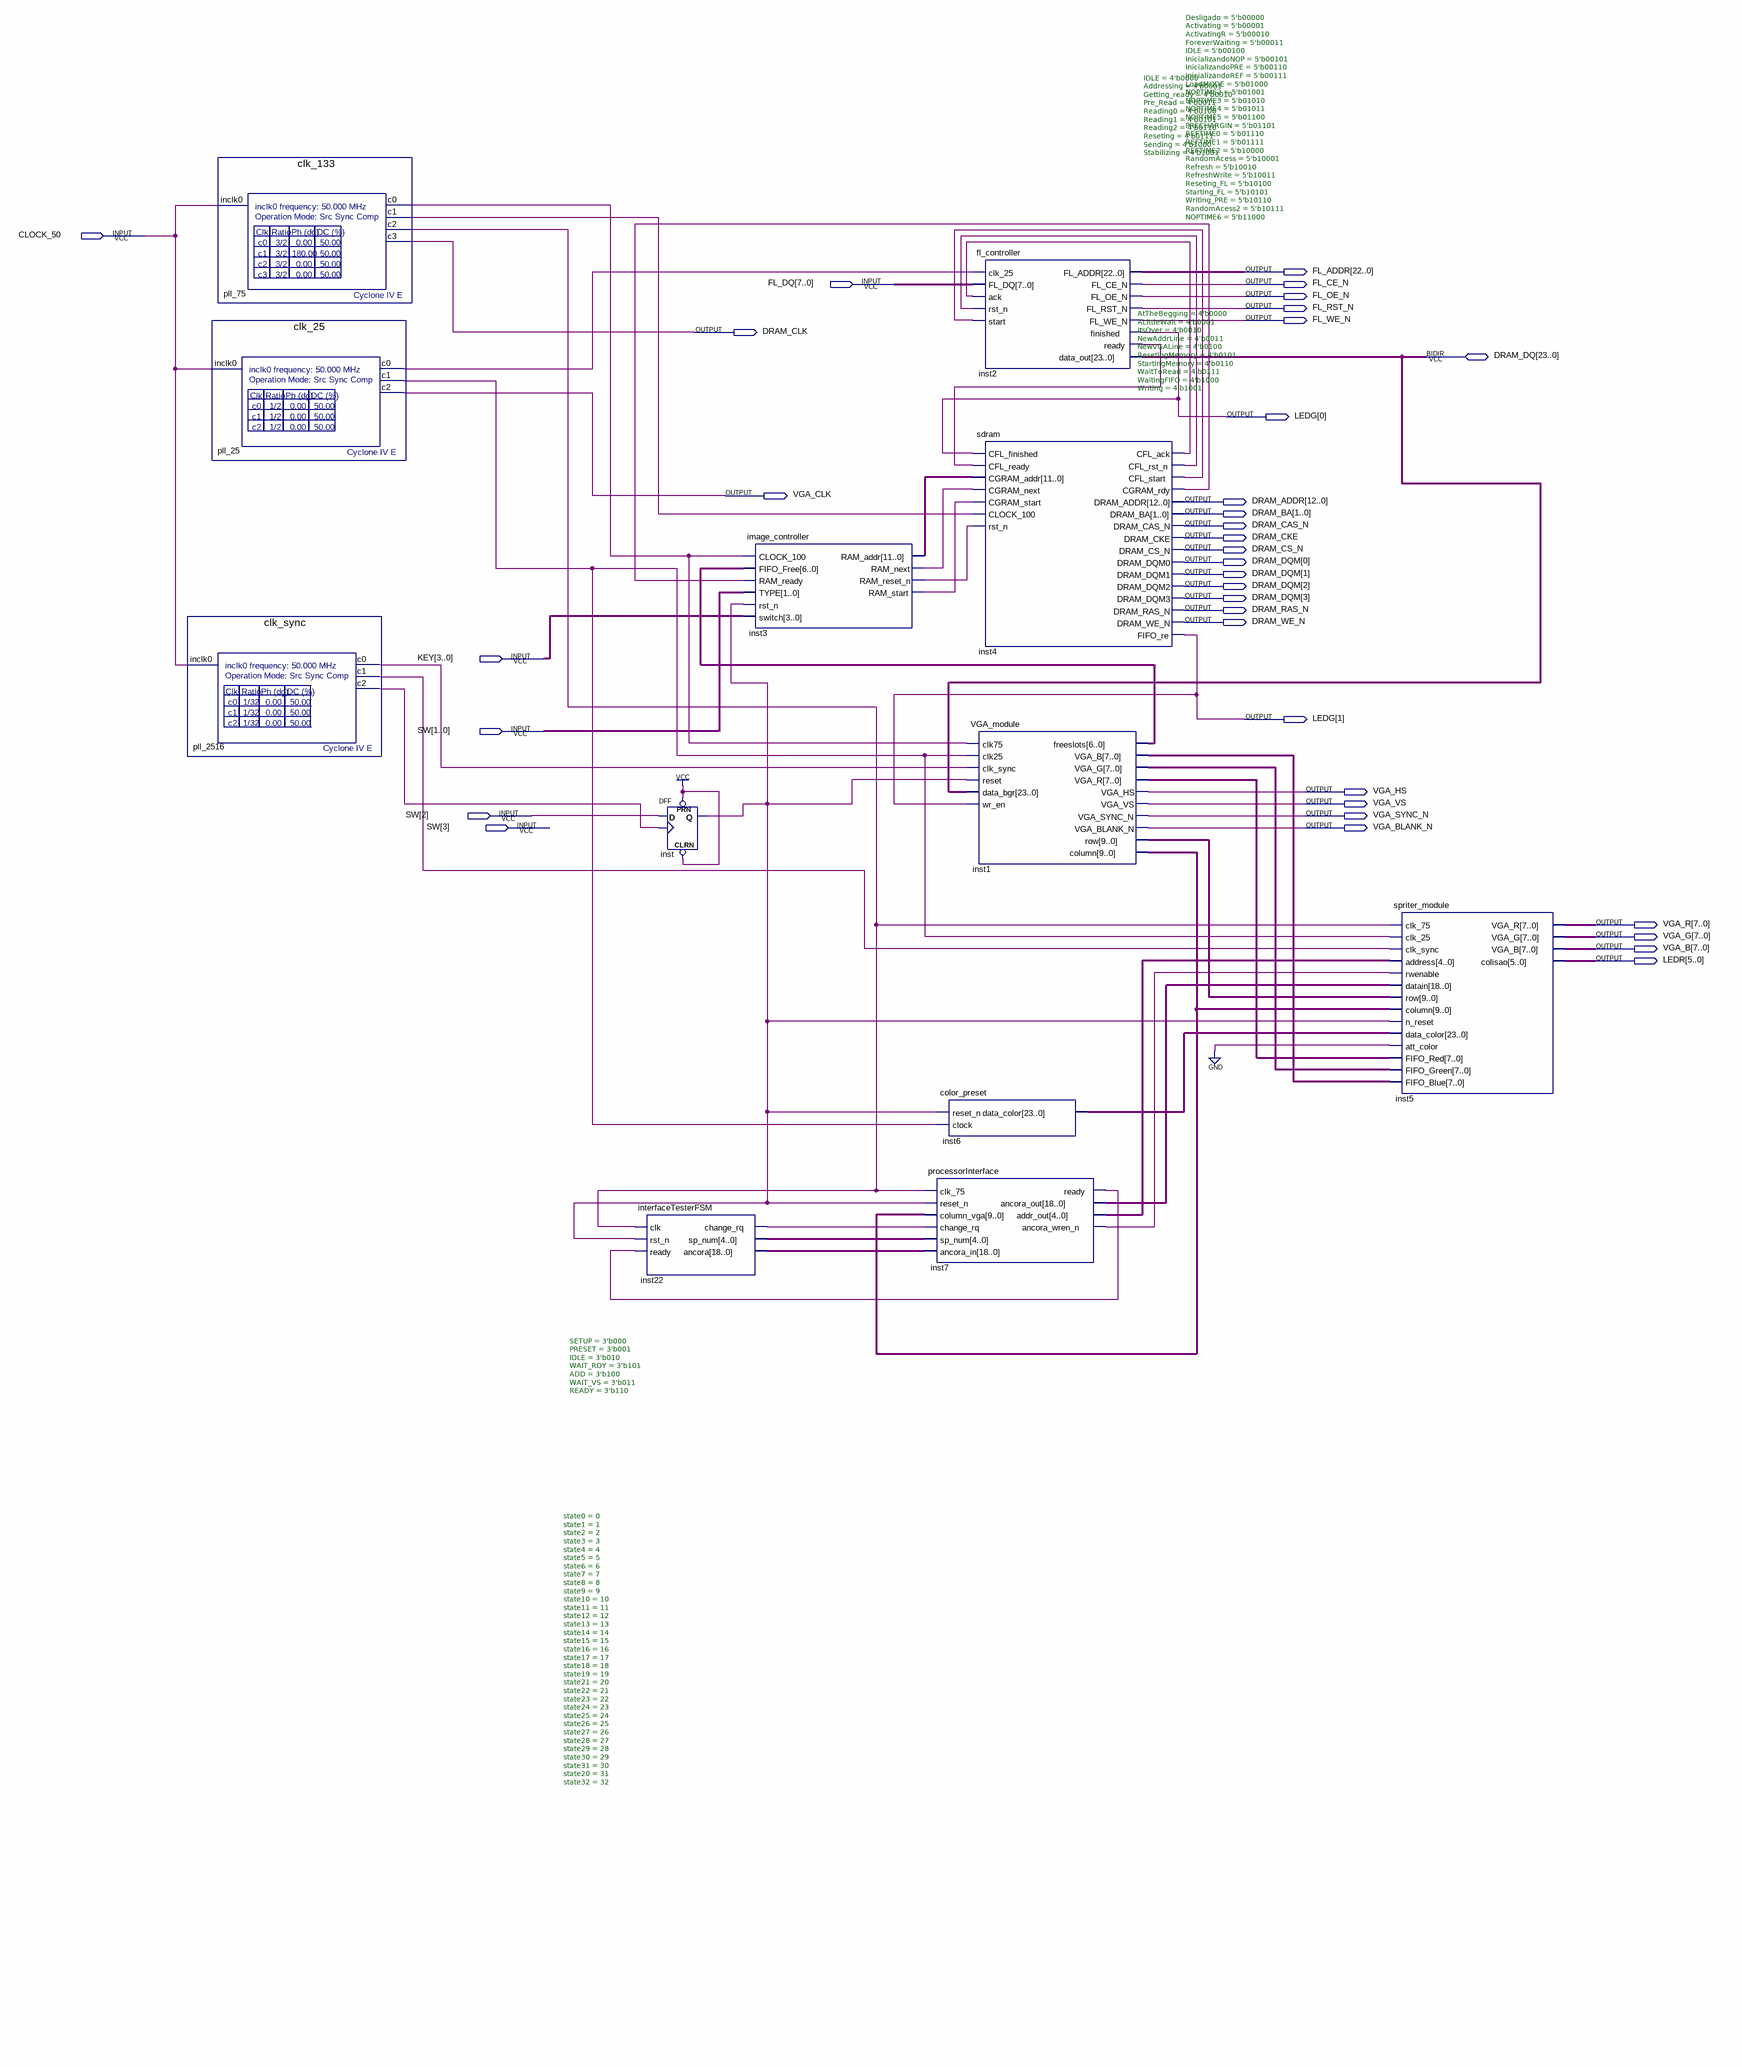
[diagram p0: schematic sheet]
// Quartus schematic LAB4.bdf as structural Verilog: 12 symbols, 35 pins
module LAB4 (
  input  CLOCK_50,
  input  [7:0] FL_DQ,
  input  [3:0] KEY,
  input  [3:0] SW,
  inout  [23:0] DRAM_DQ,
  output [22:0] FL_ADDR,
  output FL_CE_N,
  output FL_OE_N,
  output FL_RST_N,
  output FL_WE_N,
  output DRAM_CLK,
  output [1:0] LEDG,
  output VGA_CLK,
  output [12:0] DRAM_ADDR,
  output [1:0] DRAM_BA,
  output DRAM_CAS_N,
  output DRAM_CKE,
  output DRAM_CS_N,
  output [3:0] DRAM_DQM,
  output DRAM_RAS_N,
  output DRAM_WE_N,
  output VGA_HS,
  output VGA_VS,
  output VGA_SYNC_N,
  output VGA_BLANK_N,
  output [7:0] VGA_R,
  output [7:0] VGA_G,
  output [7:0] VGA_B,
  output [5:0] LEDR
);

  wire inst2_ready, inst3_ram_next, inst3_ram_reset_n, inst3_ram_start, inst4_cfl_ack, inst4_cfl_rst_n,
       inst4_cfl_start, inst4_cgram_rdy, inst7_ancora_wren_n, inst7_ready, inst22_change_rq, inst_q,
       pll_25_c0, pll_25_c1, pll_75_c0, pll_75_c1, pll_75_c2, pll_2516_c0, pll_2516_c1, pll_2516_c2;
  wire [4:0] inst7_addr_out, inst22_sp_num;
  wire [6:0] inst1_freeslots;
  wire [7:0] inst1_vga_b, inst1_vga_g, inst1_vga_r;
  wire [9:0] inst1_column, inst1_row;
  wire [11:0] inst3_ram_addr;
  wire [18:0] inst7_ancora_out, inst22_ancora;
  wire [23:0] inst6_data_color;

  clk_sync pll_2516 (.inclk0(CLOCK_50), .c0(pll_2516_c0), .c1(pll_2516_c1), .c2(pll_2516_c2));
  clk_133 pll_75 (.inclk0(CLOCK_50), .c0(pll_75_c0), .c1(pll_75_c1), .c2(pll_75_c2), .c3(DRAM_CLK));
  clk_25 pll_25 (.inclk0(CLOCK_50), .c0(pll_25_c0), .c1(pll_25_c1), .c2(VGA_CLK));
  interfaceTesterFSM #(.SETUP(3'b000), .PRESET(3'b001), .IDLE(3'b010), .WAIT_RDY(3'b101), .ADD(3'b100), .WAIT_VS(3'b011), .READY(3'b110)) inst22 (
    .clk(pll_75_c2), .rst_n(inst_q), .ready(inst7_ready), .change_rq(inst22_change_rq),
    .sp_num(inst22_sp_num), .ancora(inst22_ancora));
  DFF inst (.CLRN(1'b1), .CLK(pll_2516_c2), .D(SW[2]), .PRN(1'b1), .Q(inst_q));
  image_controller #(.AtTheBegging(4'b0000), .ALittleWait(4'b0001), .ItsOver(4'b0010), .NewAddrLine(4'b0011), .NewVGALine(4'b0100), .ResetingMemory(4'b0101), .StartingMemory(4'b0110), .WaitToRead(4'b0111), .WaitingFIFO(4'b1000), .Writing(4'b1001)) inst3 (
    .CLOCK_100(pll_75_c0), .FIFO_Free(inst1_freeslots), .RAM_ready(inst4_cgram_rdy), .TYPE(SW[1:0]),
    .rst_n(inst_q), .switch(KEY), .RAM_addr(inst3_ram_addr), .RAM_next(inst3_ram_next),
    .RAM_reset_n(inst3_ram_reset_n), .RAM_start(inst3_ram_start));
  processorInterface inst7 (
    .clk_75(pll_75_c2), .reset_n(inst_q), .column_vga(inst1_column), .change_rq(inst22_change_rq),
    .sp_num(inst22_sp_num), .ancora_in(inst22_ancora), .ready(inst7_ready), .ancora_out(inst7_ancora_out),
    .addr_out(inst7_addr_out), .ancora_wren_n(inst7_ancora_wren_n));
  fl_controller #(.IDLE(4'b0000), .Addressing(4'b0001), .Getting_ready(4'b0010), .Pre_Read(4'b0011), .Reading0(4'b0100), .Reading1(4'b0101), .Reading2(4'b0110), .Reseting(4'b0111), .Sending(4'b1000), .Stabilizing(4'b1001)) inst2 (
    .clk_25(pll_25_c0), .FL_DQ(FL_DQ), .ack(inst4_cfl_ack), .rst_n(inst4_cfl_rst_n), .start(inst4_cfl_start),
    .FL_ADDR(FL_ADDR), .FL_CE_N(FL_CE_N), .FL_OE_N(FL_OE_N), .FL_RST_N(FL_RST_N), .FL_WE_N(FL_WE_N),
    .finished(LEDG[0]), .ready(inst2_ready), .data_out(DRAM_DQ));
  sdram #(.Desligado(5'b00000), .Activating(5'b00001), .ActivatingR(5'b00010), .ForeverWaiting(5'b00011), .IDLE(5'b00100), .InicializandoNOP(5'b00101), .InicializandoPRE(5'b00110), .InicializandoREF(5'b00111), .LoadMODE(5'b01000), .NOPTIME2(5'b01001), .NOPTIME3(5'b01010), .NOPTIME4(5'b01011), .NOPTIME5(5'b01100), .PRECHARGIN(5'b01101), .REFTIME0(5'b01110), .REFTIME1(5'b01111), .REFTIME2(5'b10000), .RandomAcess(5'b10001), .Refresh(5'b10010), .RefreshWrite(5'b10011), .Reseting_FL(5'b10100), .Starting_FL(5'b10101), .Writing_PRE(5'b10110), .RandomAcess2(5'b10111), .NOPTIME6(5'b11000)) inst4 (
    .CFL_finished(LEDG[0]), .CFL_ready(inst2_ready), .CGRAM_addr(inst3_ram_addr),
    .CGRAM_next(inst3_ram_next), .CGRAM_start(inst3_ram_start), .CLOCK_100(pll_75_c1),
    .rst_n(inst3_ram_reset_n), .CFL_ack(inst4_cfl_ack), .CFL_rst_n(inst4_cfl_rst_n),
    .CFL_start(inst4_cfl_start), .CGRAM_rdy(inst4_cgram_rdy), .DRAM_ADDR(DRAM_ADDR), .DRAM_BA(DRAM_BA),
    .DRAM_CAS_N(DRAM_CAS_N), .DRAM_CKE(DRAM_CKE), .DRAM_CS_N(DRAM_CS_N), .DRAM_DQM0(DRAM_DQM[0]),
    .DRAM_DQM1(DRAM_DQM[1]), .DRAM_DQM2(DRAM_DQM[2]), .DRAM_DQM3(DRAM_DQM[3]), .DRAM_RAS_N(DRAM_RAS_N),
    .DRAM_WE_N(DRAM_WE_N), .FIFO_re(LEDG[1]));
  VGA_module inst1 (
    .clk75(pll_75_c0), .clk25(pll_25_c1), .clk_sync(pll_2516_c0), .reset(inst_q), .data_bgr(DRAM_DQ),
    .wr_en(LEDG[1]), .freeslots(inst1_freeslots), .VGA_B(inst1_vga_b), .VGA_G(inst1_vga_g),
    .VGA_R(inst1_vga_r), .VGA_HS(VGA_HS), .VGA_VS(VGA_VS), .VGA_SYNC_N(VGA_SYNC_N),
    .VGA_BLANK_N(VGA_BLANK_N), .row(inst1_row), .column(inst1_column));
  color_preset #(.state0(0), .state1(1), .state2(2), .state3(3), .state4(4), .state5(5), .state6(6), .state7(7), .state8(8), .state9(9), .state10(10), .state11(11), .state12(12), .state13(13), .state14(14), .state15(15), .state16(16), .state17(17), .state18(18), .state19(19), .state21(20), .state22(21), .state23(22), .state24(23), .state25(24), .state26(25), .state27(26), .state28(27), .state29(28), .state30(29), .state31(30), .state20(31), .state32(32)) inst6 (
    .reset_n(inst_q), .clock(pll_25_c1), .data_color(inst6_data_color));
  spriter_module inst5 (
    .clk_75(pll_75_c2), .clk_25(pll_25_c1), .clk_sync(pll_2516_c1), .address(inst7_addr_out),
    .rwenable(inst7_ancora_wren_n), .datain(inst7_ancora_out), .row(inst1_row), .column(inst1_column),
    .n_reset(inst_q), .data_color(inst6_data_color), .att_color(1'b0), .FIFO_Red(inst1_vga_r),
    .FIFO_Green(inst1_vga_g), .FIFO_Blue(inst1_vga_b), .VGA_R(VGA_R), .VGA_G(VGA_G), .VGA_B(VGA_B),
    .colisao(LEDR));
endmodule
